# EAGLE design avrisp-level-transl (EAGLE 7.2.0)
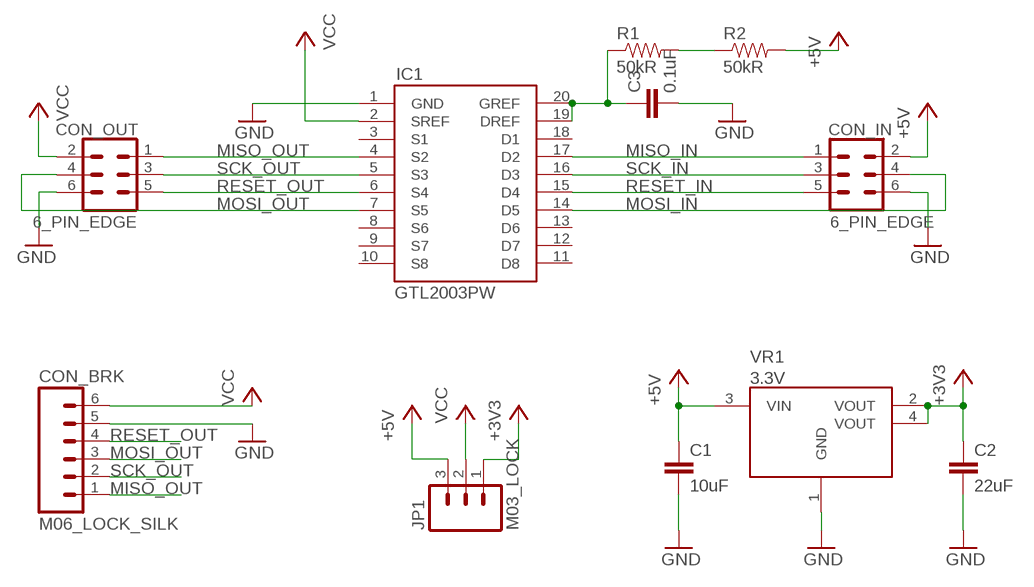
[diagram p0: schematic, sheet 1]

## Parts
C1  10uF  CAPACITOR0805  [0805]
C2  22uF  CAPACITOR0805  [0805]
C3  0.1uF  CAPACITOR0805  [0805]
CON_BRK  M06_LOCK_SILK  [M06_LOCK_SILK]
CON_IN  6_PIN_EDGE  [6_PIN_EDGE]
CON_OUT  6_PIN_EDGE  [6_PIN_EDGE]
IC1  GTL2003PW  [TSSOP-20]
JP1  M03_LOCK  [M03_LOCK]
R1  50kR  RESISTOR0805  [0805]
R2  50kR  RESISTOR0805  [0805]
VR1  3.3V  AMS1117_SOT223  [SOT223]

## Nets
+3V3: C2.1 JP1.1 VR1.2(VOUT) VR1.4(VOUT)
+5V: C1.1 CON_IN.2 JP1.3 R2.2 VR1.3(VIN)
GND: C1.2 C2.2 C3.2 CON_BRK.5 CON_IN.6 CON_OUT.6 IC1.1(GND) VR1.1(GND)
MISO_IN: CON_IN.1 IC1.17(D2)
MISO_OUT: CON_BRK.1 CON_OUT.1 IC1.4(S2)
MOSI_IN: CON_IN.4 IC1.14(D5)
MOSI_OUT: CON_BRK.3 CON_OUT.4 IC1.7(S5)
N$1: C3.1 IC1.19(DREF) IC1.20(GREF) R1.1
N$2: R1.2 R2.1
RESET_IN: CON_IN.5 IC1.15(D4)
RESET_OUT: CON_BRK.4 CON_OUT.5 IC1.6(S4)
SCK_IN: CON_IN.3 IC1.16(D3)
SCK_OUT: CON_BRK.2 CON_OUT.3 IC1.5(S3)
VCC: CON_BRK.6 CON_OUT.2 IC1.2(SREF) JP1.2
Unconnected: IC1.3(S1) IC1.8(S6) IC1.9(S7) IC1.10(S8) IC1.11(D8) IC1.12(D7) IC1.13(D6) IC1.18(D1)

## Library data of the parts
C1-C3 = flabbergast:CAPACITOR
CON_BRK = flabbergast:M06
CON_IN CON_OUT = flabbergast:6_PIN_EDGE
IC1 = flabbergast:GTL2003
JP1 = flabbergast:M03
R1 R2 = flabbergast:RESISTOR
VR1 = flabbergast:AMS1117

## Board
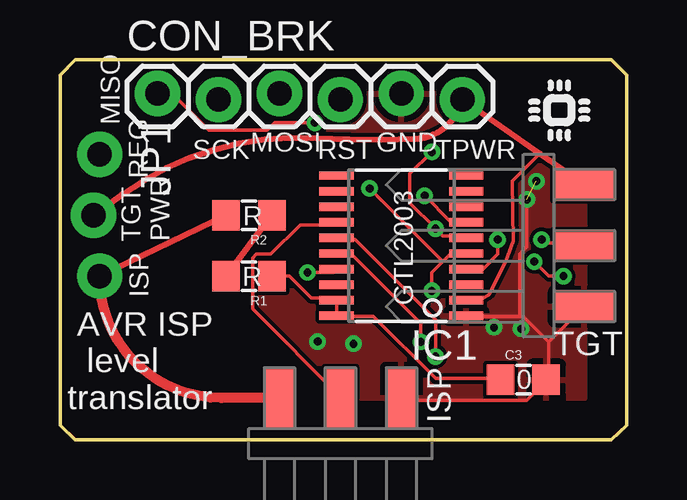
[diagram p1: board, top side]
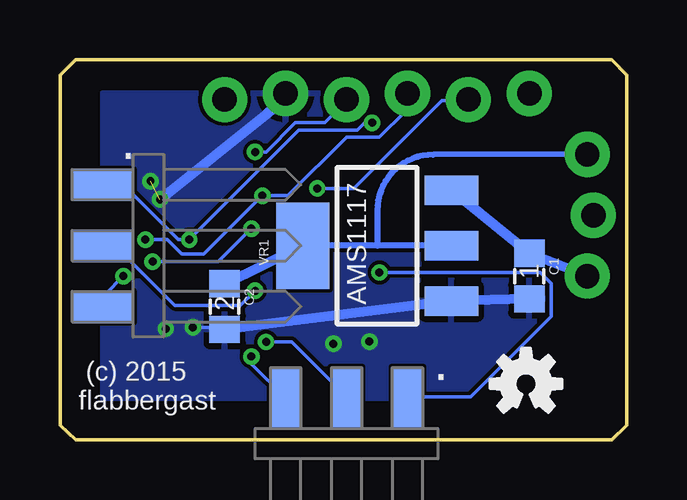
[diagram p2: board, bottom side, seen from below]

Size 23.62 x 15.85 mm. Coordinates in mm from the lower left corner, seen from the top.
Outline: 22.96,0 0.63,0 0,0.61 0,15.21 0.63,15.85 22.96,15.85 23.62,15.21 23.62,0.61 22.96,0
Copper layers (1*16): Top 0.0356mm / dielectric 1.5011mm / Bottom 0.0356mm
Design rules "LaenPCBOrder *": minimum track width 6mil, minimum drill 13mil, track to track 6mil, track to pad 6mil, pad to pad 6mil, via to via 6mil, smd to smd 6mil, copper to edge 15mil, drill to drill 6mil, minimum pad ring 7mil, minimum via ring 7mil, stop-mask expansion 3mil, vias tented up to drill 30mil, thermal gap 10mil

### Footprints (pad centres in the part's own frame; a part is rotated, then mirrored left to right if it is on the bottom)
0805 = smd 1.143 x 1.27: 1 -0.953,0; 2 0.953,0
M06_LOCK_SILK = drill 1.016 pad 1.88: 1 0,0; 2 2.54,-0.254; 3 5.08,0; 4 7.62,-0.254; 5 10.16,0; 6 12.7,-0.254
6_PIN_EDGE = smd 1.27 x 2.54: 1 2.54,1.27; 3 0,1.27; 5 -2.54,1.27 | smd 1.27 x 2.54 bottom: 2 2.54,1.27; 4 0,1.27; 6 -2.54,1.27
TSSOP-20 = smd 0.35 x 1.43: 1 -2.925,-2.7; 2 -2.275,-2.7; 3 -1.625,-2.7; 4 -0.975,-2.7; 5 -0.325,-2.7; 6 0.325,-2.7; 7 0.975,-2.7; 8 1.625,-2.7; 9 2.275,-2.7; 10 2.925,-2.7; 11 2.925,2.7; 12 2.275,2.7; 13 1.625,2.7; 14 0.975,2.7; 15 0.325,2.7; 16 -0.325,2.7; 17 -0.975,2.7; 18 -1.625,2.7; 19 -2.275,2.7; 20 -2.925,2.7
M03_LOCK = drill 1.016 pad 1.88: 1 0,0.127; 2 2.54,-0.127; 3 5.08,0.127
SOT223 = smd 1.219 x 2.235: 1 -2.311,-3.099; 2 0,-3.099; 3 2.311,-3.099 | smd 3.6 x 2.2: 4 0,3.099

### Placement (x,y rotation side)
C1  4.06,6.83 270 bottom
C2  16.76,5.56 270 bottom
C3  19.3,2.51 0 top
CON_BRK  4.06,14.45 0 top
CON_IN  11.68,0.48 0 bottom
CON_OUT  20.57,8.1 90 bottom
IC1  14.22,8.1 90 top
JP1  1.52,11.91 270 top
R1  7.87,6.83 180 top
R2  7.87,9.37 180 top
U$1  [IC_TINY]  20.8,13.75 0 top
U$2  [OSHW-LOGO-S]  4.2,2.34 0 bottom
VR1  10.41,8.1 90 bottom

### Tracks (layer width: path | path; a pad name or v marks a point on that pad's centre or on a via)
+3V3
  Bottom 0.254: VR1.2 10.4,8.1 | 10.4,8.1 VR1.4 | JP1.1 8.08,11.9 arc-90 10.4,9.58 10.4,8.1
  Bottom 0.406: C2.1 VR1.4
+5V
  Top 0.254: R2.2 JP1.3
  Top 0.406: CON_IN.2 6.73,1.75 arc-90 JP1.3
  Bottom 0.406: JP1.3 C1.1 VR1.3
GND  (via drill 0.33)  (1 unrouted)
  Top 0.152: 20.37,4.09 20.37,2.57 C3.2 20.22,2.41 19.46,1.65 14.27,1.65 CON_IN.6 | CON_OUT.6 20.37,4.09 | 19.15,5.16 19.3,5.16 20.37,4.09 | 19.15,5.16 18.09,5.16 | 18.09,5.16 17.02,5.16 IC1.1 | v19.46,10.03 19.46,8.05 19.15,7.75 19.15,5.16 | 18.09,5.16 v18.09,4.7
  Bottom 0.152: 14.73,14.45 CON_BRK.5 | v18.09,4.7 16.87,4.7 C2.2
  Bottom 0.406: C1.2 VR1.1 C2.2 | v19.46,10.03 14.95,13.65 arc-18 CON_BRK.5
  other vias: 10.73,4.1 12.23,4.01 19.22,4.64 19.85,10.79
  pour Top: 1.52,14.45 21.84,14.45 21.84,1.75 1.52,1.75
  pour Bottom: 1.52,14.45 21.84,14.45 21.84,1.75 1.52,1.75
MISO_IN  (via drill 0.33)
  Top 0.152: v10.31,6.98 11.38,6.98 IC1.17
  Bottom 0.152: v10.31,6.98 3.61,6.98 3.15,6.53 3.15,5.16 6.5,1.8 9.09,1.8 CON_IN.1
MISO_OUT  (via drill 0.33)
  Top 0.152: v18.24,8.36 18.24,7.75 17.63,7.14 17.02,7.14 IC1.4 | CON_BRK.1 4.67,14.45 6.2,12.93 8.64,12.93 8.94,13.23 v10.62,13.23
  Bottom 0.152: CON_OUT.1 20.98,10.64 18.69,8.36 v18.24,8.36 13.66,12.93 11.23,12.93 10.92,13.23 v10.62,13.23
MOSI_IN
  Top 0.152: IC1.14 11.38,8.97 10.01,8.97 8.79,7.75 8.18,7.75 8.03,7.59 8.03,5.46 11.68,1.8 CON_IN.4
MOSI_OUT  (via drill 0.33)
  Top 0.152: v15.19,10.19 16.26,9.12 16.87,9.12 IC1.7 | v20.07,8.36 20.22,8.2 21.74,8.2 CON_OUT.4
  Bottom 0.152: CON_BRK.3 9.25,14.45 9.25,13.69 10.31,12.62 11.68,12.62 14.12,10.19 v15.19,10.19 17.63,7.75 18.54,7.75 19.15,8.36 v20.07,8.36
N$1
  Top 0.152: R1.1 9.55,6.83 10.46,5.92 11.38,5.92 IC1.19 11.53,5.77 11.53,5.31 IC1.20 11.53,5.16 13.06,5.16 15.65,2.57 18.24,2.57 C3.1
N$2
  Top 0.254: R1.2 R2.1
RESET_IN  (via drill 0.33)
  Top 0.152: v15.65,3.48 15.65,5 12.29,8.36 11.53,8.36 IC1.15
  Bottom 0.152: v15.65,3.48 15.65,3.17 CON_IN.5
RESET_OUT  (via drill 0.33)
  Top 0.152: v15.49,12.01 14.58,11.1 14.58,9.88 v15.65,8.81 15.95,8.51 16.87,8.51 IC1.6 | v20.98,6.83 20.37,6.83 v19.76,7.44
  Bottom 0.152: v15.49,12.01 15.04,12.01 13.82,13.23 12.6,13.23 11.68,14.15 CON_BRK.4 | v20.98,6.83 21.74,6.07 21.74,5.61 CON_OUT.5 | v19.76,7.44 17.02,7.44 v15.65,8.81
SCK_IN  (via drill 0.33)
  Top 0.152: v15.04,4.09 15.04,4.85 12.14,7.75 11.53,7.75 IC1.16
  Bottom 0.152: v15.04,4.09 13.97,4.09 11.68,1.8 CON_IN.3
SCK_OUT  (via drill 0.33)
  Top 0.152: 15.95,7.44 15.49,6.98 v15.49,6.22 | 15.95,7.44 16.26,7.75 16.87,7.75 IC1.5 | 15.95,7.44 v12.9,10.49
  Bottom 0.152: v15.49,6.22 16.1,5.61 18.85,5.61 21.29,8.05 21.74,8.05 CON_OUT.3 | v12.9,10.49 11.38,10.49 7.72,14.15 6.66,14.15 CON_BRK.2
VCC
  Top 0.152: IC1.2 17.02,5.92 17.63,5.92 17.86,6.06 18.57,7.44 18.89,8.29 18.85,10.79 19.91,11.86 19.98,11.95
  Top 0.254: CON_OUT.2 19.98,11.95 CON_BRK.6 arc-75 14.78,12.56 arc-6 10.68,12.6 arc39 2.59,10.24 JP1.2

### Text on the board
tPlace: MISO | SCK | MOSI | RST | GND | TPWR | REG | R | TGT / PWR | ISP | R | GTL2003 | TGT | 0 | AVR ISP / level / translator | ISP
bPlace: . | 1 | AMS1117 | 2 | . | (c) 2015 / flabbergast